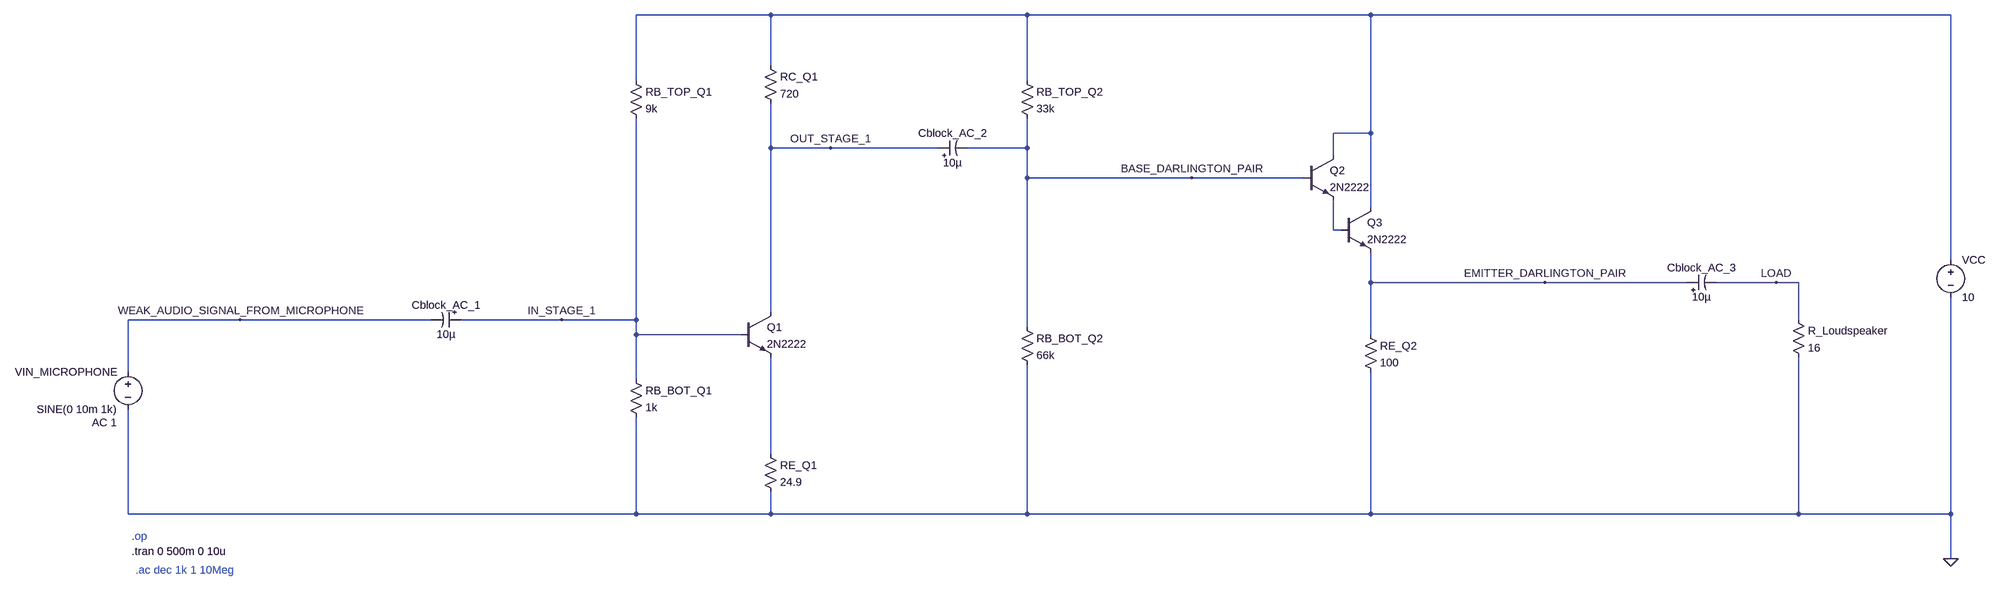
[diagram p0: schematic BJT_Audio_Amp.asc]
BJT_Audio_Amp.asc, the LTspice schematic file:
Version 4.1
SHEET 1 3164 680
WIRE -1888 -784 -2176 -784
WIRE -1040 -784 -1888 -784
WIRE -304 -784 -1040 -784
WIRE 1168 -784 -304 -784
WIRE -1888 -640 -1888 -784
WIRE -2176 -608 -2176 -784
WIRE -1040 -608 -1040 -784
WIRE -304 -496 -304 -784
WIRE -304 -496 -384 -496
WIRE -1888 -464 -1888 -560
WIRE -1760 -464 -1888 -464
WIRE -1232 -464 -1760 -464
WIRE -1040 -464 -1040 -528
WIRE -1040 -464 -1168 -464
WIRE -384 -448 -384 -496
WIRE -1040 -400 -1040 -464
WIRE -688 -400 -1040 -400
WIRE -448 -400 -688 -400
WIRE -304 -336 -304 -496
WIRE -384 -288 -384 -352
WIRE -368 -288 -384 -288
WIRE 1168 -224 1168 -784
WIRE -304 -176 -304 -240
WIRE 80 -176 -304 -176
WIRE 384 -176 80 -176
WIRE 576 -176 448 -176
WIRE 624 -176 576 -176
WIRE -1888 -112 -1888 -464
WIRE -3168 -96 -3408 -96
WIRE -2720 -96 -3168 -96
WIRE -2336 -96 -2656 -96
WIRE -2176 -96 -2176 -528
WIRE -2176 -96 -2336 -96
WIRE 624 -96 624 -176
WIRE -1040 -80 -1040 -400
WIRE -2176 -64 -2176 -96
WIRE -1952 -64 -2176 -64
WIRE -304 -64 -304 -176
WIRE -3408 16 -3408 -96
WIRE -2176 32 -2176 -64
WIRE -1888 192 -1888 -16
WIRE -3408 320 -3408 96
WIRE -2176 320 -2176 112
WIRE -2176 320 -3408 320
WIRE -1888 320 -1888 272
WIRE -1888 320 -2176 320
WIRE -1040 320 -1040 0
WIRE -1040 320 -1888 320
WIRE -304 320 -304 16
WIRE -304 320 -1040 320
WIRE 624 320 624 -16
WIRE 624 320 -304 320
WIRE 1168 320 1168 -144
WIRE 1168 320 624 320
WIRE 1168 416 1168 320
FLAG 1168 416 0
FLAG -2336 -96 IN_STAGE_1
FLAG 576 -176 LOAD
FLAG 80 -176 EMITTER_DARLINGTON_PAIR
FLAG -3168 -96 WEAK_AUDIO_SIGNAL_FROM_MICROPHONE
FLAG -688 -400 BASE_DARLINGTON_PAIR
FLAG -1760 -464 OUT_STAGE_1
DATAFLAG -176 -176 ""
DATAFLAG -928 -400 ""
DATAFLAG -1520 -464 ""
DATAFLAG -1888 -240 ""
DATAFLAG -2080 -64 ""
DATAFLAG -1888 80 ""
SYMBOL res 608 -112 R0
SYMATTR InstName R_Loudspeaker
SYMATTR Value 16
SYMBOL voltage 1168 -240 R0
WINDOW 123 0 0 Left 0
WINDOW 39 0 0 Left 0
SYMATTR InstName VCC
SYMATTR Value 10
SYMBOL voltage -3408 0 M0
WINDOW 123 24 124 Left 2
WINDOW 39 0 0 Left 0
SYMATTR Value2 AC 1
SYMATTR InstName VIN_MICROPHONE
SYMATTR Value SINE(0 10m 1k)
SYMBOL polcap -2656 -112 R90
WINDOW 0 0 32 VBottom 2
WINDOW 3 32 32 VTop 2
SYMATTR InstName Cblock_AC_1
SYMATTR Value 10µ
SYMBOL polcap -1232 -448 R270
WINDOW 0 32 32 VTop 2
WINDOW 3 0 32 VBottom 2
SYMATTR InstName Cblock_AC_2
SYMATTR Value 10µ
SYMBOL npn -368 -336 R0
SYMATTR InstName Q3
SYMATTR Value 2N2222
SYMBOL res -320 -80 R0
SYMATTR InstName RE_Q2
SYMATTR Value 100
SYMBOL res -1056 -624 R0
SYMATTR InstName RB_TOP_Q2
SYMATTR Value 33k
SYMBOL res -1056 -96 R0
SYMATTR InstName RB_BOT_Q2
SYMATTR Value 66k
SYMBOL polcap 384 -160 R270
WINDOW 0 32 32 VTop 2
WINDOW 3 0 32 VBottom 2
SYMATTR InstName Cblock_AC_3
SYMATTR Value 10µ
SYMBOL npn -1952 -112 R0
SYMATTR InstName Q1
SYMATTR Value 2N2222
SYMBOL res -2192 -624 R0
SYMATTR InstName RB_TOP_Q1
SYMATTR Value 9k
SYMBOL res -2192 16 R0
SYMATTR InstName RB_BOT_Q1
SYMATTR Value 1k
SYMBOL res -1904 176 R0
SYMATTR InstName RE_Q1
SYMATTR Value 24.9
SYMBOL res -1904 -656 R0
SYMATTR InstName RC_Q1
SYMATTR Value 720
SYMBOL npn -448 -448 R0
SYMATTR InstName Q2
SYMATTR Value 2N2222
TEXT -3400 368 Left 2 ;.op
TEXT -3400 400 Left 2 !.tran 0 500m 0 10u
TEXT -3392 440 Left 2 ;.ac dec 1k 1 10Meg

The netlist it stands for:
* BJT_Audio_Amp.asc
R_Loudspeaker LOAD 0 16
VCC N001 0 10
VIN_MICROPHONE WEAK_AUDIO_SIGNAL_FROM_MICROPHONE 0 SINE(0 10m 1k) AC 1
Cblock_AC_1 IN_STAGE_1 WEAK_AUDIO_SIGNAL_FROM_MICROPHONE 10µ
Cblock_AC_2 OUT_STAGE_1 BASE_DARLINGTON_PAIR 10µ
Q3 N001 N002 EMITTER_DARLINGTON_PAIR 0 2N2222
RE_Q2 EMITTER_DARLINGTON_PAIR 0 100
RB_TOP_Q2 N001 BASE_DARLINGTON_PAIR 33k
RB_BOT_Q2 BASE_DARLINGTON_PAIR 0 66k
Cblock_AC_3 EMITTER_DARLINGTON_PAIR LOAD 10µ
Q1 OUT_STAGE_1 IN_STAGE_1 N003 0 2N2222
RB_TOP_Q1 N001 IN_STAGE_1 9k
RB_BOT_Q1 IN_STAGE_1 0 1k
RE_Q1 N003 0 24.9
RC_Q1 N001 OUT_STAGE_1 720
Q2 N001 BASE_DARLINGTON_PAIR N002 0 2N2222
.model NPN NPN
.model PNP PNP
.lib standard.bjt
* .op
.tran 0 500m 0 10u
* .ac dec 1k 1 10Meg
.backanno
.end